# EAGLE design EnvironmentOnAStick (EAGLE 7.4.0)
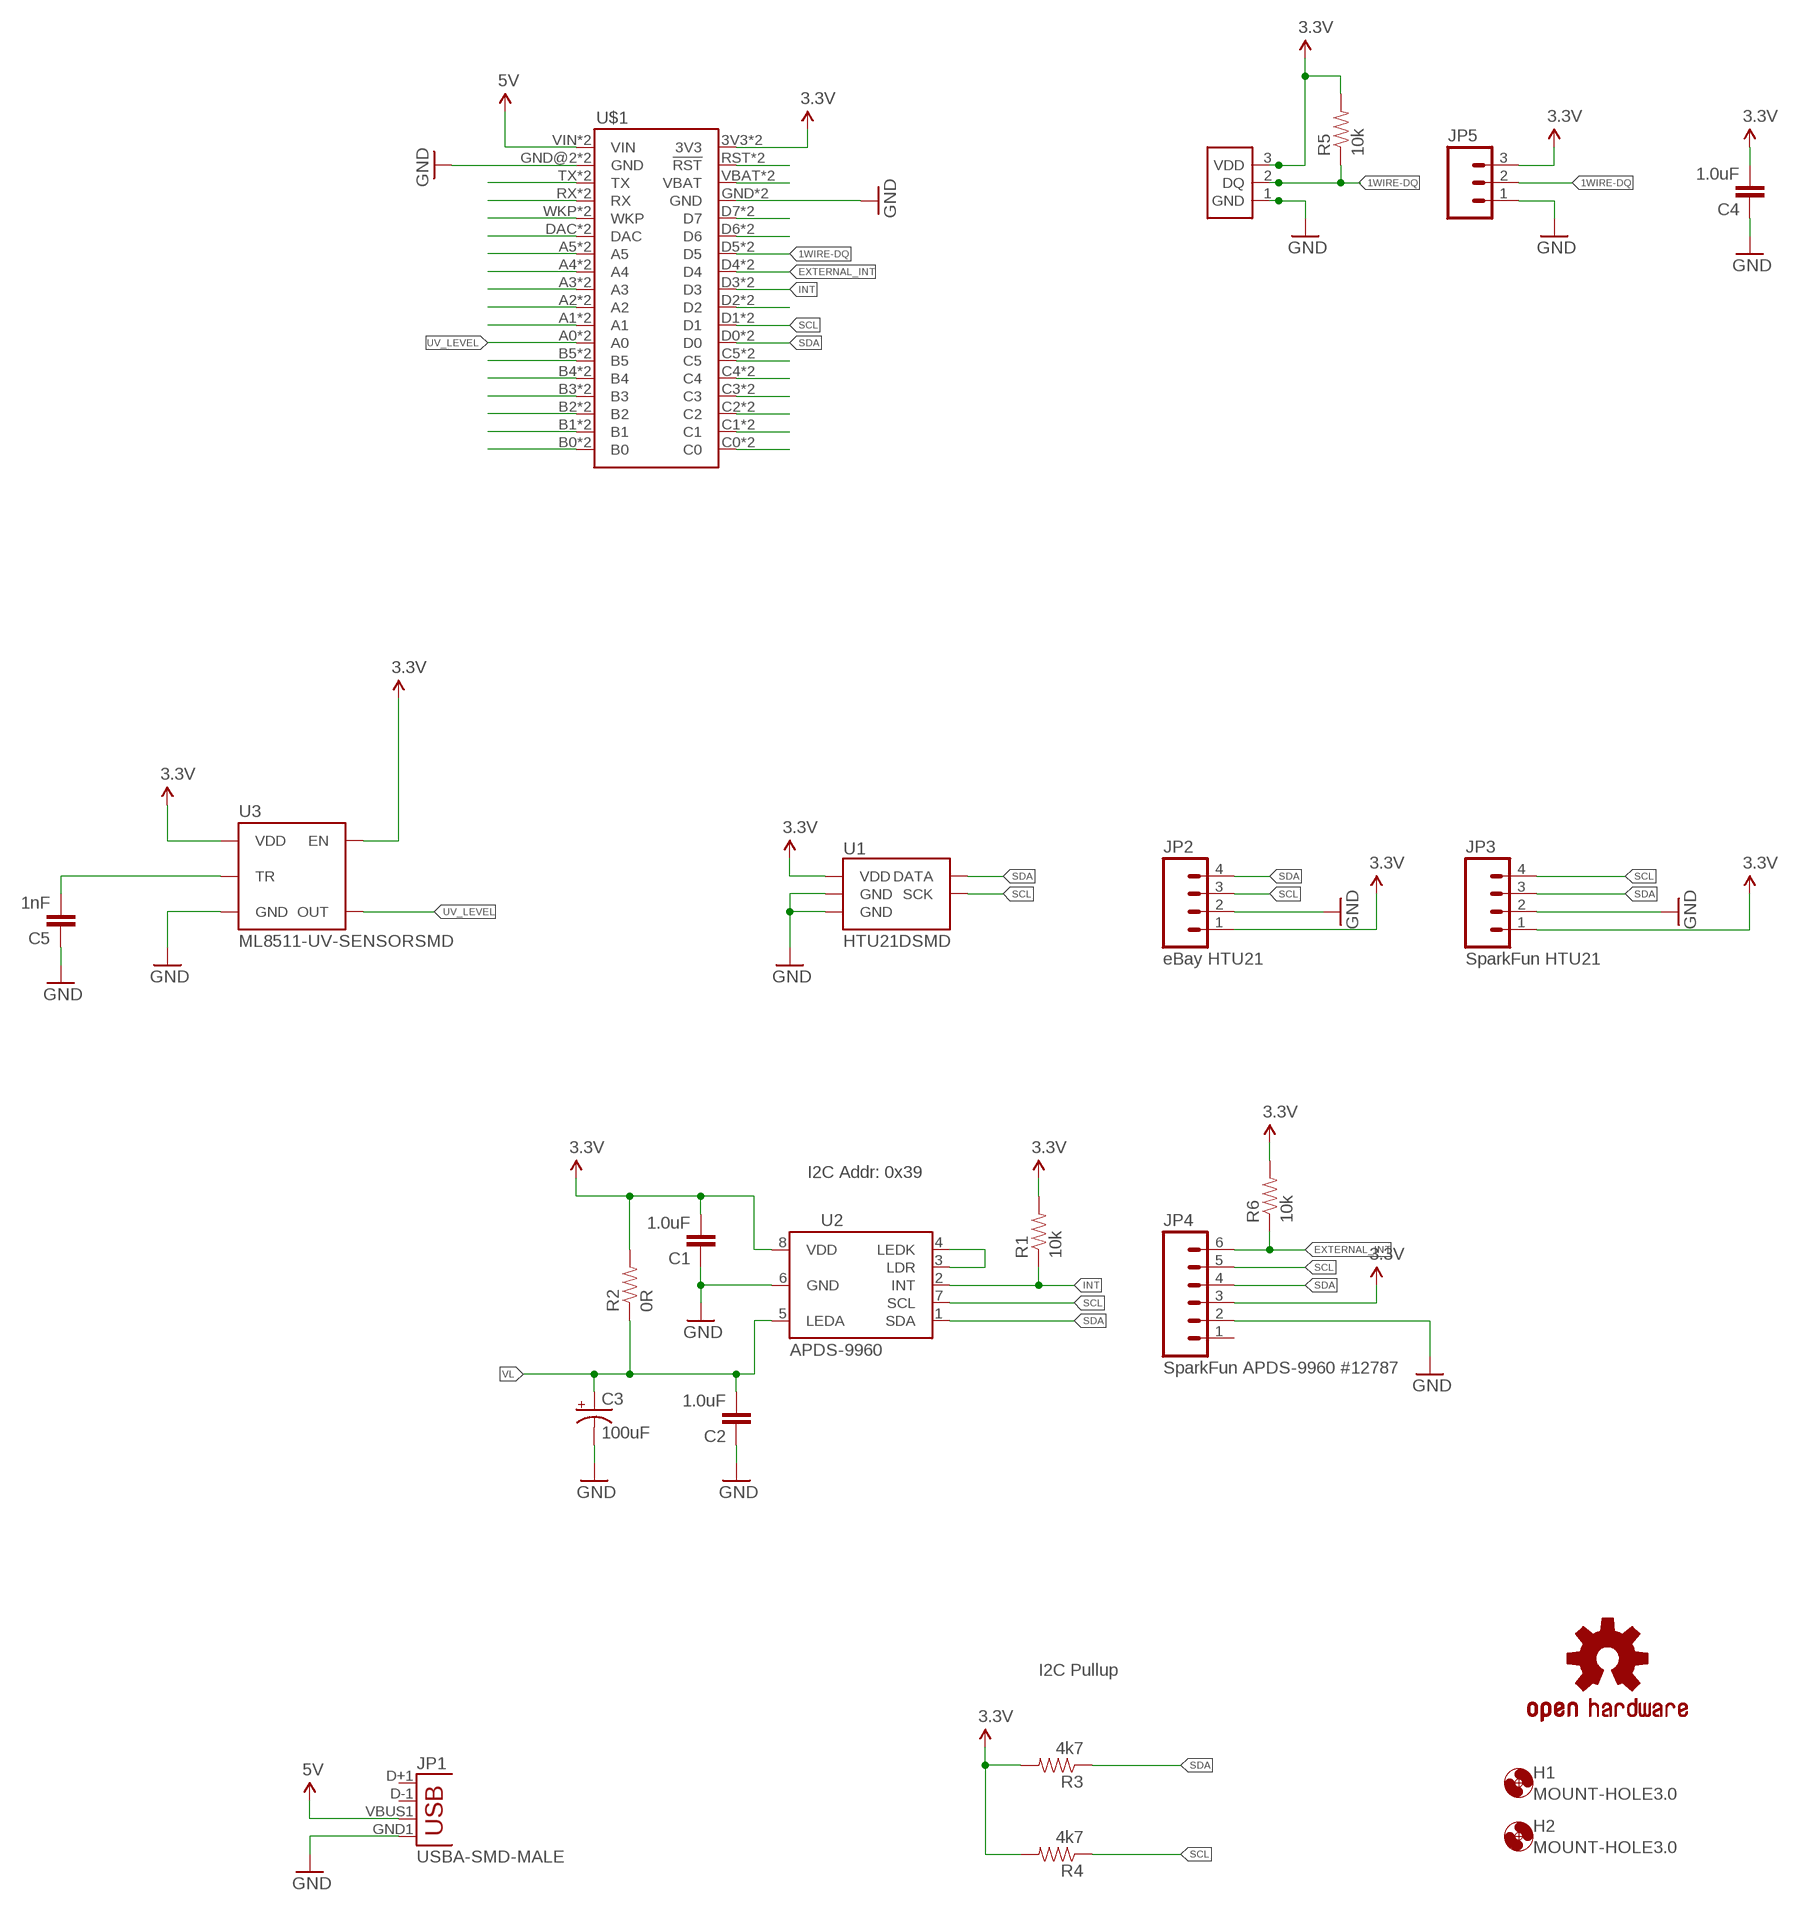
[diagram p0: schematic, sheet 1]

## Parts
C1  1.0uF  1.0UF-25V-+80/-20(0805)"  [0805-CAP]
C2  1.0uF  1.0UF-25V-+80/-20(0805)"  [0805-CAP]
C3  100uF  100UF-10V-10%(TANT)  [EIA7343]
C4  1.0uF  1.0UF-25V-+80/-20(0805)"  [0805-CAP]
C5  1nF  1.0UF-25V-+80/-20(0805)"  [0805-CAP]
H1  MOUNT-HOLE3.0  [3,0]
H2  MOUNT-HOLE3.0  [3,0]
JP1  USBA-SMD-MALE  [USB-A-SMT-MALE]
JP2  eBay HTU21  M04PTH  [1X04]
JP3  SparkFun HTU21  M04PTH  [1X04]
JP4  SparkFun APDS-9960 #12787  M06SILK_FEMALE_PTH  [1X06]
JP5  M03POLAR  [MOLEX-1X3]
LOGO1  OSHW-LOGOM  [OSHW-LOGO-M]
R1  10k  RESISTOR0805-RES  [0805]
R2  0R  RESISTOR0805-RES  [0805]
R3  4k7  RESISTOR0805-RES  [0805]
R4  4k7  RESISTOR0805-RES  [0805]
R5  10k  RESISTOR0805-RES  [0805]
R6  10k  RESISTOR0805-RES  [0805]
S1  SENSOR-DS18B20  [TO-92-TRIANGLE]
U1  HTU21DSMD  [HTU21D]
U2  APDS-9960  [APDS-9960]
U3  ML8511-UV-SENSORSMD  [ML8511]
U$1  ELECTRONDUALNAMED  [ELECTRON_SIMPLE_SILK_NAMES_DUAL]

## Nets
1WIRE-DQ: JP5.2 R5.1 S1.2(DQ) U$1.D5 U$1.D5_1(D5)
3.3V: C1.2 C4.2 JP2.1 JP3.1 JP4.3 JP5.3 R1.2 R2.2 R3.2 R4.2 R5.2 R6.2 S1.3(VDD) U1.VDD U2.8(VDD) U3.4(EN) U3.7(VDD) U$1.3V3 U$1.3V3_1(3V3)
5V: JP1.VBUS1(VBUS) U$1.VIN U$1.VIN_1B(VIN)
EXTERNAL_INT: JP4.6 R6.1 U$1.D4 U$1.D4_1(D4)
GND: C1.1 C2.1 C3.C(-) C4.1 C5.1 JP1.GND1(GND) JP2.2 JP3.2 JP4.2 JP5.1 S1.1(GND) U1.7(GND) U1.GND U2.6(GND) U3.5(GND) U$1.GND U$1.GND@2(GND) U$1.GND_1(GND) U$1.GND_1B(GND)
INT: R1.1 U2.2(INT) U$1.D3 U$1.D3_1(D3)
N$1: U$1.RST(!RST) U$1.RST_1(!RST)
N$2: U$1.VBAT U$1.VBATT_1(VBAT)
N$3: U$1.D7 U$1.D7_1(D7)
N$4: U$1.D6 U$1.D6_1(D6)
N$5: C5.2 U3.10(TR)
N$8: U$1.D2 U$1.D2_1(D2)
N$11: U$1.C5 U$1.C5_1(C5)
N$12: U$1.C4 U$1.C4_1(C4)
N$13: U$1.C3 U$1.C3_1(C3)
N$14: U$1.C2 U$1.C2_1(C2)
N$15: U$1.C1 U$1.C1_1(C1)
N$16: U$1.C0 U$1.C0_1(C0)
N$17: U$1.B0 U$1.B0_1(B0)
N$18: U$1.B1 U$1.B1_1(B1)
N$19: U$1.B2 U$1.B2_1(B2)
N$20: U$1.B3 U$1.B3_1(B3)
N$21: U$1.B4 U$1.B4_1(B4)
N$22: U$1.B5 U$1.B5_1(B5)
N$24: U$1.A1 U$1.A1_1(A1)
N$25: U$1.A2 U$1.A2_1(A2)
N$26: U$1.A3 U$1.A3_1(A3)
N$27: U$1.A4 U$1.A4_1(A4)
N$28: U$1.A5 U$1.A5_1(A5)
N$29: U$1.DAC U$1.DAC_1(DAC)
N$30: U$1.WKP U$1.WKP_1(WKP)
N$31: U$1.RX U$1.RX_1(RX)
N$32: U$1.TX U$1.TX_1(TX)
N$34: U2.3(LDR) U2.4(LEDK)
SCL: JP2.3 JP3.4 JP4.5 R4.1 U1.SCK U2.7(SCL) U$1.D1 U$1.D1_1(D1)
SDA: JP2.4 JP3.3 JP4.4 R3.1 U1.DATA U2.1(SDA) U$1.D0 U$1.D0_1(D0)
UV_LEVEL: U3.8(OUT) U$1.A0 U$1.A0_1(A0)
VL: C2.2 C3.A(+) R2.1 U2.5(LEDA)
Unconnected: JP1.D+1(D+) JP1.D-1(D-) JP4.1

## Notes on the sheet
- I2C Addr: 0x39
- I2C Pullup

## Library data of the parts
C1 C2 C4 = SparkFun-Capacitors:1.0UF-25V-+80/-20(0805): CAP-11625; PROD_ID: CAP-11625
C3 = SparkFun-Capacitors:100UF-10V-10%(TANT): CAP-07890; PROD_ID: CAP-07890
C5 = SparkFun-Capacitors:1.0UF-25V-+80/-20(0805): CAP-11625; PROD_ID: CAP-11625; VALUE: 1.0uF
H1 H2 = holes:MOUNT-HOLE: MOUNTING HOLE with drill center marker
JP1 = Tinamous:USB: USB Connectors USB-B-PTH is fully proven SKU : PRT-00139/CONN-08278 USB-miniB is fully proven SKU : PRT-00587 USB-A-PCB is untested. USB-A-H is throughly reviewed, but untested. Spark Fun Electronics SKU : PRT-00437 USB-B-SMT is throughly reviewed, but untested. Needs silkscreen touching up. USB-A-S has not been used/tested USB-MB-H has not been used/tested USB-MICROB has been used. CONN-09505
JP2 JP3 = SparkFun-Connectors:M04: Header 4 Standard 4-pin 0.1" header. Use with straight break away headers (SKU : PRT-00116), right angle break away headers (PRT-00553), swiss pins (PRT-00743), machine pins (PRT-00117), and female headers (PRT-00115). Molex polarized connector foot print use with SKU : PRT-08231 with associated crimp pins and housings. 1MM SMD Version SKU: PRT-10208
JP4 = SparkFun-Connectors:M06: Header 6 Standard 6-pin 0.1" header. Use with straight break away headers (SKU : PRT-00116), right angle break away headers (PRT-00553), swiss pins (PRT-00743), machine pins (PRT-00117), and female headers (PRT-00115). Molex polarized connector foot print use with SKU : PRT-08094 with associated crimp pins and housings. NOTES ON THE VARIANTS LOCK and LOCK_LONGPADS... This footprint was designed to help hold the alignment of a through-hole component (i.e. 6-pin header) while soldering it into place. You may notice that each hole has been shifted either up or down by 0.005 of an inch from it's more standard position (which is a perfectly straight line). This slight alteration caused the pins (the squares in the middle) to touch the edges of the holes. Because they are alternating, it causes a "brace" to hold the component in place. 0.005 has proven to be the perfect amount of "off-center" position when using our standard breakaway headers. Although looks a little odd when you look at the bare footprint, once you have a header in there, the alteration is very hard to notice. Also,if you push a header all the way into place, it is covered up entirely on the bottom side. This idea of altering the position of holes to aid alignment will be further integrated into the Sparkfun Library for other footprints. It can help hold any component with 3 or more connection pins.; PROD_ID: CONN-08437
JP5 = SparkFun-Connectors:M03: Header 3 Standard 3-pin 0.1" header. Use with straight break away headers (SKU : PRT-00116), right angle break away headers (PRT-00553), swiss pins (PRT-00743), machine pins (PRT-00117), and female headers (PRT-00115). Molex polarized connector foot print use with SKU : PRT-08232 with associated crimp pins and housings.
LOGO1 = SparkFun-Aesthetics:OSHW-LOGO: Open Source Hardware Logo This logo indicates the piece of hardware it is found on incorporates a OSHW license and/or adheres to the definition of open source hardware found here: http://freedomdefined.org/OSHW
R1-R6 = SparkFun-Resistors:RESISTOR: Resistor Basic schematic elements and footprints for 0603, 1206, and PTH resistors.
S1 = SENSOR-DS18B20:SENSOR-DS18B20
U1 = SparkFun-Sensors:HTU21D; PROD_ID: IC-11793
U2 = SparkFun-Sensors:APDS-9960: Avago APDS-9960 digital proximity, ambient light, RGB, and gesture sensor.; PROD_ID: SEN-12005
U3 = SparkFun-Sensors:ML8511-UV-SENSOR; PROD_ID: IC-11927
U$1 = Tinamous:ELECTRON

## Board
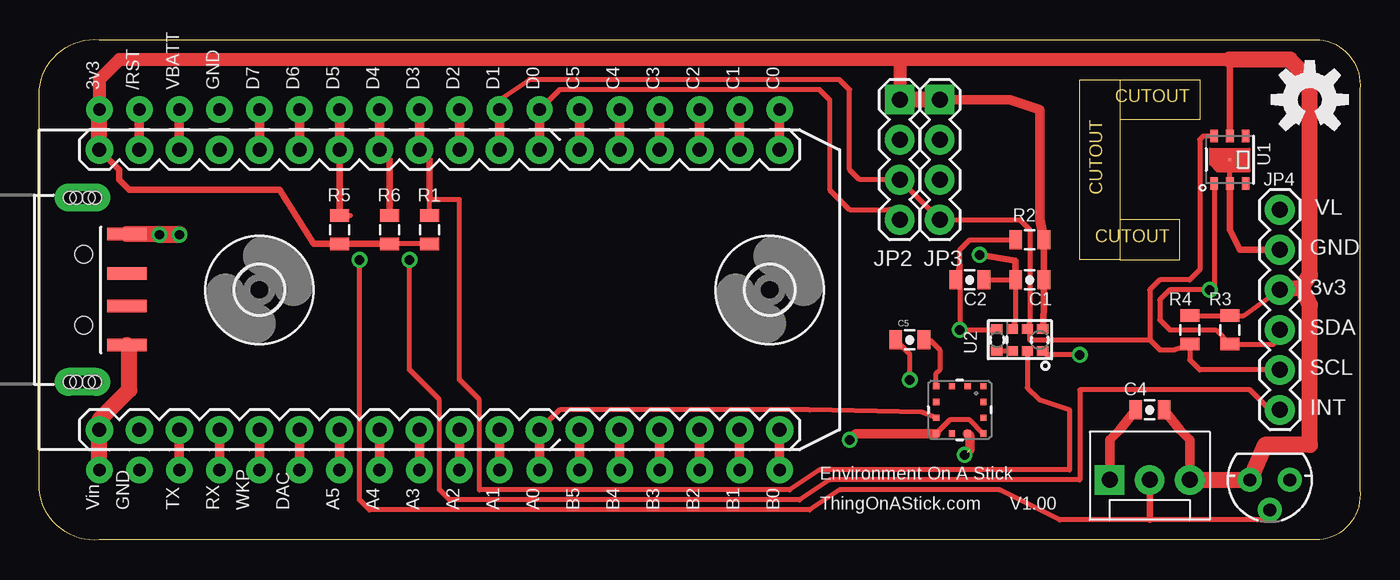
[diagram p1: board, top side]
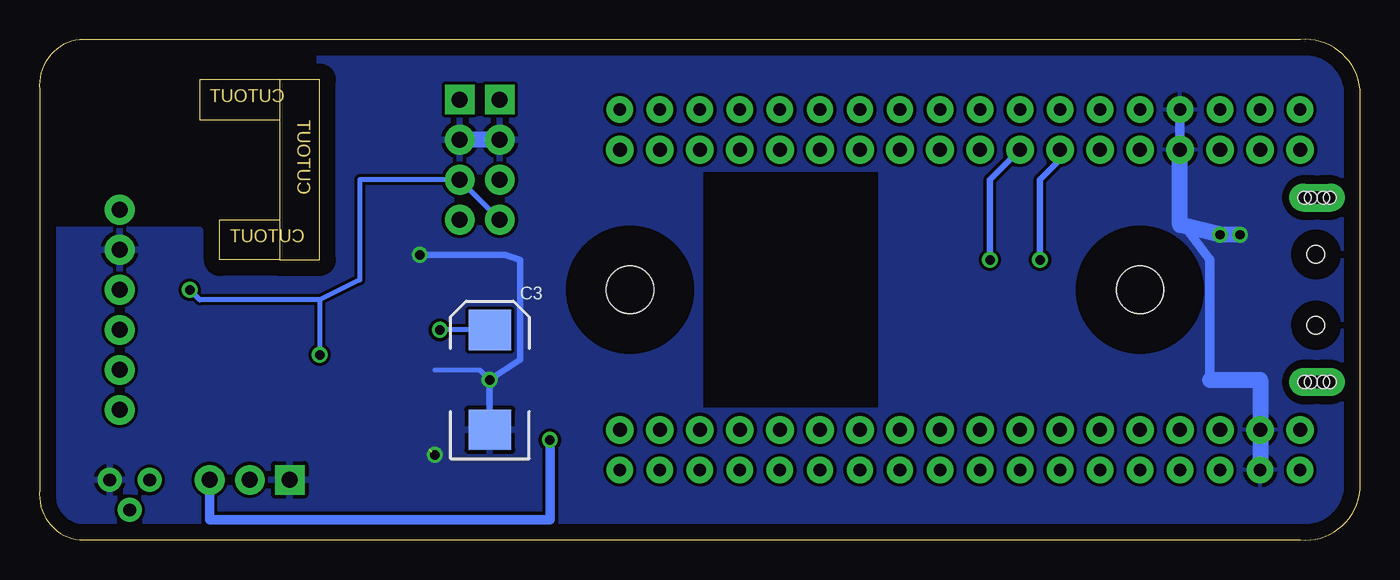
[diagram p2: board, bottom side, seen from below]

Size 83.84 x 31.78 mm. Coordinates in mm from the lower left corner, seen from the top.
Outline: 68.58,29.22 66.04,29.22 66.04,17.79 68.58,17.79
Outline: 68.58,29.22 68.58,26.68
Outline: 68.58,26.68 68.58,20.33
Outline: 68.58,20.33 68.58,17.79
Outline: 68.58,17.79 72.39,17.79 72.39,20.33 68.58,20.33
Outline: 68.58,29.22 73.66,29.22 73.66,26.68 68.58,26.68
Outline: 0,3.19 0,28.59 arc-90 3.81,31.76 81.28,31.76 arc-90 83.82,28.59 83.82,3.19 arc-90 81.28,0.01 3.81,0.01 arc-90 0,3.19
Copper layers (1*16): Top 0.035mm / dielectric 1.5mm / Bottom 0.035mm
Design rules "default": minimum track width 10mil, minimum drill 24mil, track to track 8mil, track to pad 8mil, pad to pad 8mil, via to via 8mil, smd to smd 8mil, copper to edge 40mil, drill to drill 8mil, minimum pad ring 10mil, minimum via ring 8mil, stop-mask expansion 4mil, vias tented up to drill 0mil, thermal gap 10mil

### Footprints (pad centres in the part's own frame; a part is rotated, then mirrored left to right if it is on the bottom)
0805-CAP = smd 0.8 x 1.2: 1 -0.9,0; 2 0.9,0
EIA7343 = smd 2.55 x 2.7: A 3.17,0; C -3.17,0
3,0 = hole 3: 0,0
USB-A-SMT-MALE = smd 0.8 x 2.5: D+1 1.027,-5.87; D-1 -1.027,-5.87; GND1 3.551,-5.87; VBUS1 -3.5,-5.87 | drill 0.8 pad 1.778 long: P$1 5.85,-3.05; P$3 -5.85,-3.05 | hole 1.1: 2.25,-3.12; -2.25,-3.12 | hole 0.8: -5.85,-3.45; -5.85,-3.85; -5.85,-2.65; -5.85,-2.25; 5.85,-3.45; 5.85,-3.85; 5.85,-2.65; 5.85,-2.25
1X04 = drill 1.016 pad 1.88 square: 1 0,0 | drill 1.016 pad 1.88: 2 2.54,0; 3 5.08,0; 4 7.62,0
1X06 = drill 1.016 pad 1.88: 1 0,0; 2 2.54,0; 3 5.08,0; 4 7.62,0; 5 10.16,0; 6 12.7,0
MOLEX-1X3 = drill 1.016 pad 1.88 square: 1 0,0 | drill 1.016 pad 1.88: 2 2.54,0; 3 5.08,0
0805 = smd 0.8 x 1.2: 1 -0.9,0; 2 0.9,0
TO-92-TRIANGLE = drill 0.813 pad 1.524: 1 -1.27,0; 2 0,1.905; 3 1.27,0
HTU21D = smd 0.2 x 0.2: 7 0,0 | smd 0.8 x 0.5: DATA 1.5,-1; GND 1.5,0; NC@1 -1.5,1; NC@6 1.5,1; SCK -1.5,-1; VDD -1.5,0
APDS-9960 = smd 0.6 x 0.72: 1 0.7,1.455; 2 0.7,0.485; 3 0.7,-0.485; 4 0.7,-1.455; 5 -0.7,-1.455; 6 -0.7,-0.485; 7 -0.7,0.485; 8 -0.7,1.455
ML8511 = smd 0.4 x 0.4: 1 -1.5,-1.5; 2 -1.5,-0.5; 3 -1.5,0.5; 4 -1.5,1.5; 5 -0.5,1.5; 6 0.5,1.5; 7 1.5,1.5; 8 1.5,0.5; 9 1.5,-0.5; 10 1.5,-1.5; 11 0.5,-1.5; 12 -0.5,-1.5
ELECTRON_SIMPLE_SILK_NAMES_DUAL = drill 0.889 pad 1.753: 3V3 1.27,22.86; A0 29.21,5.08; A1 26.67,5.08; A2 24.13,5.08; A3 21.59,5.08; A4 19.05,5.08; A5 16.51,5.08; B0 44.45,5.08; B1 41.91,5.08; B2 39.37,5.08; B3 36.83,5.08; B4 34.29,5.08; B5 31.75,5.08; C0 44.45,22.86; C1 41.91,22.86; C2 39.37,22.86; C3 36.83,22.86; C4 34.29,22.86; C5 31.75,22.86; D0 29.21,22.86; D1 26.67,22.86; D2 24.13,22.86; D3 21.59,22.86; D4 19.05,22.86; D5 16.51,22.86; D6 13.97,22.86; D7 11.43,22.86; DAC 13.97,5.08; GND 8.89,22.86; GND@2 3.81,5.08; RST 3.81,22.86; RX 8.89,5.08; TX 6.35,5.08; VBAT 6.35,22.86; VIN 1.27,5.08; WKP 11.43,5.08 | drill 0.8 pad 1.676: 3V3_1 1.27,25.4; A0_1 29.21,2.54; A1_1 26.67,2.54; A2_1 24.13,2.54; A3_1 21.59,2.54; A4_1 19.05,2.54; A5_1 16.51,2.54; B0_1 44.45,2.54; B1_1 41.91,2.54; B2_1 39.37,2.54; B3_1 36.83,2.54; B4_1 34.29,2.54; B5_1 31.75,2.54; C0_1 44.45,25.4; C1_1 41.91,25.4; C2_1 39.37,25.4; C3_1 36.83,25.4; C4_1 34.29,25.4; C5_1 31.75,25.4; D0_1 29.21,25.4; D1_1 26.67,25.4; D2_1 24.13,25.4; D3_1 21.59,25.4; D4_1 19.05,25.4; D5_1 16.51,25.4; D6_1 13.97,25.4; D7_1 11.43,25.4; DAC_1 13.97,2.54; GND_1 8.89,25.4; GND_1B 3.81,2.54; RST_1 3.81,25.4; RX_1 8.89,2.54; TX_1 6.35,2.54; VBATT_1 6.35,25.4; VIN_1B 1.27,2.54; WKP_1 11.43,2.54

### Placement (x,y rotation side)
C1  62.87,16.52 0 top
C2  59.05,16.52 180 top
C3  55.24,10.17 90 bottom
C4  70.48,8.27 0 top
C5  55.24,12.71 0 top
H1  13.97,15.89 0 top
H2  46.35,15.89 0 top
JP1  -0.32,15.89 90 top
JP2  54.61,27.95 270 top
JP3  57.15,27.95 270 top
JP4  78.74,20.97 270 top
JP5  67.94,3.82 0 top
LOGO1  80.64,27.95 0 top
R1  24.77,19.7 270 top
R2  62.87,19.06 0 top
R3  75.56,13.35 90 top
R4  73.03,13.35 90 top
R5  19.05,19.7 270 top
R6  22.23,19.7 270 top
S1  78.11,3.82 180 top
U1  75.56,24.14 270 top
U2  62.23,12.71 270 top
U3  58.42,8.27 180 top
U$1  2.54,1.92 0 top

### Tracks (layer width: path | path; a pad name or v marks a point on that pad's centre or on a via)
1WIRE-DQ  (via drill 0.6)
  Top 0.305: 77.79,1.28 70.48,1.28 64.77,1.28 60.96,3.19 50.8,3.19 48.9,1.92 20.95,1.92 20.32,2.55 v20.32,17.79 | R5.1 19.74,20.6
  Top 0.406: U$1.D5 R5.1 | S1.2 77.79,1.28 | JP5.2 70.48,1.28
  Top 0.61: U$1.D5_1 U$1.D5
  Bottom 0.406: v20.32,17.79 20.32,22.87 19.05,24.14 U$1.D5
3.3V  (via drill 0.6)
  Top 0.305: R1.2 R6.2 | JP4.3 76.47,14.25 R3.2 R4.2 | U3.4 59.05,7.63 57.78,7.63 U3.7
  Top 0.406: U$1.3V3 5.08,23.51 5.08,22.87 5.71,22.24 15.24,22.24 17.41,18.8 R5.2 R6.2 | U2.8 63.77,14.76 C1.2 R2.2 | U1.VDD 75.56,30.49
  Top 0.61: JP3.1 61.59,27.95 63.5,27.32 63.5,20.33 R2.2 | S1.3 76.83,3.51 | C4.2 72.39,7 73.03,6.36 JP5.3 | U3.7 51.84,6.77 v51.44,6.36
  Top 0.813: 54.61,30.49 5.08,30.49 3.81,29.22 U$1.3V3_1 | 75.56,30.49 54.61,30.49 | 54.61,30.49 JP2.1
  Top 1.016: U$1.3V3 U$1.3V3_1 | JP3.1 JP2.1 | JP4.3 80.17,16.05 | 80.17,16.05 80.64,16.84 80.64,29.22 79.38,30.49 75.56,30.49 | 80.17,16.05 80.64,14.94 80.64,6.05 77.79,6.05 S1.3 JP5.3
  Bottom 0.61: v51.44,6.36 51.44,1.28 73.03,1.28 JP5.3
5V
  Top 1.016: U$1.VIN_1B U$1.VIN 3.81,7.63 5.71,9.54 5.71,12.23 JP1.VBUS1
EXTERNAL_INT  (via drill 0.6)
  Top 0.305: JP4.6 78.11,8.27 76.83,9.54 66.04,9.54 66.04,3.82 50.16,3.82 48.26,2.55 26.04,2.55 25.4,3.19 25.4,8.9 23.5,10.81 v23.5,17.79
  Top 0.406: R6.1 22.23,24.14 U$1.D4
  Top 0.61: U$1.D4 U$1.D4_1
  Bottom 0.406: v23.5,17.79 23.5,22.87 U$1.D4
GND  (via drill 0.6)  (1 unrouted)
  Top 0.305: U1.GND U1.7 | U2.6 61.97,13.95 C1.1 C2.1 | v55.24,10.17 55.24,11.81 C5.1
  Top 0.406: C1.1 61.97,17.74 v59.69,18.11 | U1.GND 75.56,19.7 76.2,18.43 JP4.2
  Top 0.61: C4.1 68.58,7 67.94,6.36 JP5.1 | 58.92,5.59 v58.74,5.41 | 59.05,5.73 59.05,6.63 U3.5
  Top 1.016: JP1.GND1 8.89,19.44 v8.89,19.38 v7.62,19.38
  Bottom 0.305: 58.74,10.81 55.88,10.81 v55.25,10.17
  Bottom 0.406: v59.69,18.11 54.29,18.11 53.34,17.79 53.34,11.44 v55.24,10.17 v55.25,10.17 C3.C
  Bottom 0.61: 9.53,10.17 9.53,17.79 11.43,20.33 U$1.GND U$1.GND_1
  Bottom 1.016: U$1.GND 11.43,20.02 v8.89,19.38 v7.62,19.38 | 9.53,10.17 6.35,10.17 U$1.GND@2 U$1.GND_1B | JP2.2 JP3.2
  pour Bottom: 41.91,32.4 66.04,31.76 66.04,17.16 73.03,17.79 73.66,19.7 85.72,19.7 85.09,-1.89 41.91,-1.89
  pour Bottom: 41.91,23.51 30.48,23.51 30.48,8.27 41.91,8.27 41.91,-1.26 -1.27,-1.26 -1.27,33.03 9.53,33.03 33.02,32.4 41.91,32.4
INT
  Top 0.305: U2.2 62.72,9.69 63.5,8.9 65.41,8.27 65.41,4.46 49.53,4.46 47.62,3.19 27.94,3.19 27.94,8.9 26.67,10.17 26.67,21.6 24.77,21.6 R1.1
  Top 0.406: 24.77,21.6 24.77,24.14 U$1.D3
  Top 0.61: U$1.D3 U$1.D3_1
N$1
  Top 0.61: U$1.RST U$1.RST_1
N$2
  Top 0.61: U$1.VBATT_1 U$1.VBAT
N$3
  Top 0.61: U$1.D7_1 U$1.D7
N$4
  Top 0.61: U$1.D6_1 U$1.D6
N$5
  Top 0.305: U3.10 56.92,10.58 57.15,10.81 57.15,12.08 56.52,12.71 C5.2
N$8
  Top 0.61: U$1.D2_1 U$1.D2
N$11
  Top 0.61: U$1.C5 U$1.C5_1
N$12
  Top 0.61: U$1.C4_1 U$1.C4
N$13
  Top 0.61: U$1.C3 U$1.C3_1
N$14
  Top 0.61: U$1.C2_1 U$1.C2
N$15
  Top 0.61: U$1.C1 U$1.C1_1
N$16
  Top 0.61: U$1.C0_1 U$1.C0
N$17
  Top 0.61: U$1.B0 U$1.B0_1
N$18
  Top 0.61: U$1.B1_1 U$1.B1
N$19
  Top 0.61: U$1.B2 U$1.B2_1
N$20
  Top 0.61: U$1.B3_1 U$1.B3
N$21
  Top 0.61: U$1.B4 U$1.B4_1
N$22
  Top 0.61: U$1.B5_1 U$1.B5
N$24
  Top 0.61: U$1.A1_1 U$1.A1
N$25
  Top 0.61: U$1.A2 U$1.A2_1
N$26
  Top 0.61: U$1.A3_1 U$1.A3
N$27
  Top 0.61: U$1.A4 U$1.A4_1
N$28
  Top 0.61: U$1.A5 U$1.A5_1
N$29
  Top 0.61: U$1.DAC U$1.DAC_1
N$30
  Top 0.61: U$1.WKP U$1.WKP_1
N$31
  Top 0.61: U$1.RX U$1.RX_1
N$32
  Top 0.61: U$1.TX U$1.TX_1
N$34
  Top 0.305: U2.4 U2.3
SCL
  Top 0.305: 29.21,27.95 31.11,29.22 50.8,29.22 51.44,28.59 51.44,23.51 52.07,22.87 JP2.3 JP3.4 62.23,20.33 62.87,19.7 62.87,13.9 | JP4.5 73.66,10.81 73.03,11.44 R4.1 72.02,12.08 71.12,12.08 70.48,12.71 | 62.87,13.56 62.87,12.71 70.48,12.71 | 62.87,13.56 62.87,13.9 | 62.87,13.9 U2.7 62.87,13.56 | U1.SCK 73.89,25.64 73.66,25.41 73.66,17.16 73.03,16.52 71.12,16.52 70.48,15.89 70.48,12.71
  Top 0.406: U$1.D1 29.21,27.95
  Top 0.61: U$1.D1 U$1.D1_1
SDA  (via drill 0.6)
  Top 0.305: U$1.D0_1 33.02,28.59 49.53,28.59 50.16,27.95 50.16,22.24 51.44,20.97 53.98,20.97 JP2.4 | 74.56,22.51 U1.DATA 74.61,22.6 74.61,16.21 v74.3,15.89 71.75,15.89 71.12,15.25 71.12,13.98 71.75,13.35 74.67,13.35 R3.1 78.37,12.45 JP4.4 | v66.04,11.76 63.94,11.76 U2.1
  Top 0.61: U$1.D0_1 U$1.D0
  Bottom 0.305: JP2.4 JP3.3 63.5,22.87 63.5,16.52 66.04,15.25 | 66.04,15.25 v66.04,11.76 | 66.04,15.25 73.66,15.25 v74.3,15.89
UV_LEVEL
  Top 0.305: U3.8 56.02,8.13 48.9,8.27 33.02,8.27 U$1.A0
  Top 0.61: U$1.A0 U$1.A0_1
VL  (via drill 0.6)
  Top 0.305: 58.42,17.53 C2.2 | 58.42,17.53 58.42,18.43 59.05,19.06 R2.1 | U2.5 60.7,13.34 v58.42,13.34 58.42,17.53
  Bottom 0.305: C3.A v58.42,13.34

### Text on the board
Dimension: CUTOUT | CUTOUT | CUTOUT
tNames: VL | GND | 3v3 | SDA | SCL | INT | Environment On A Stick | ThingOnAStick.com | V1.00